# EAGLE design bricl_i2c_3axis_lis331hh (EAGLE 7.2.0)
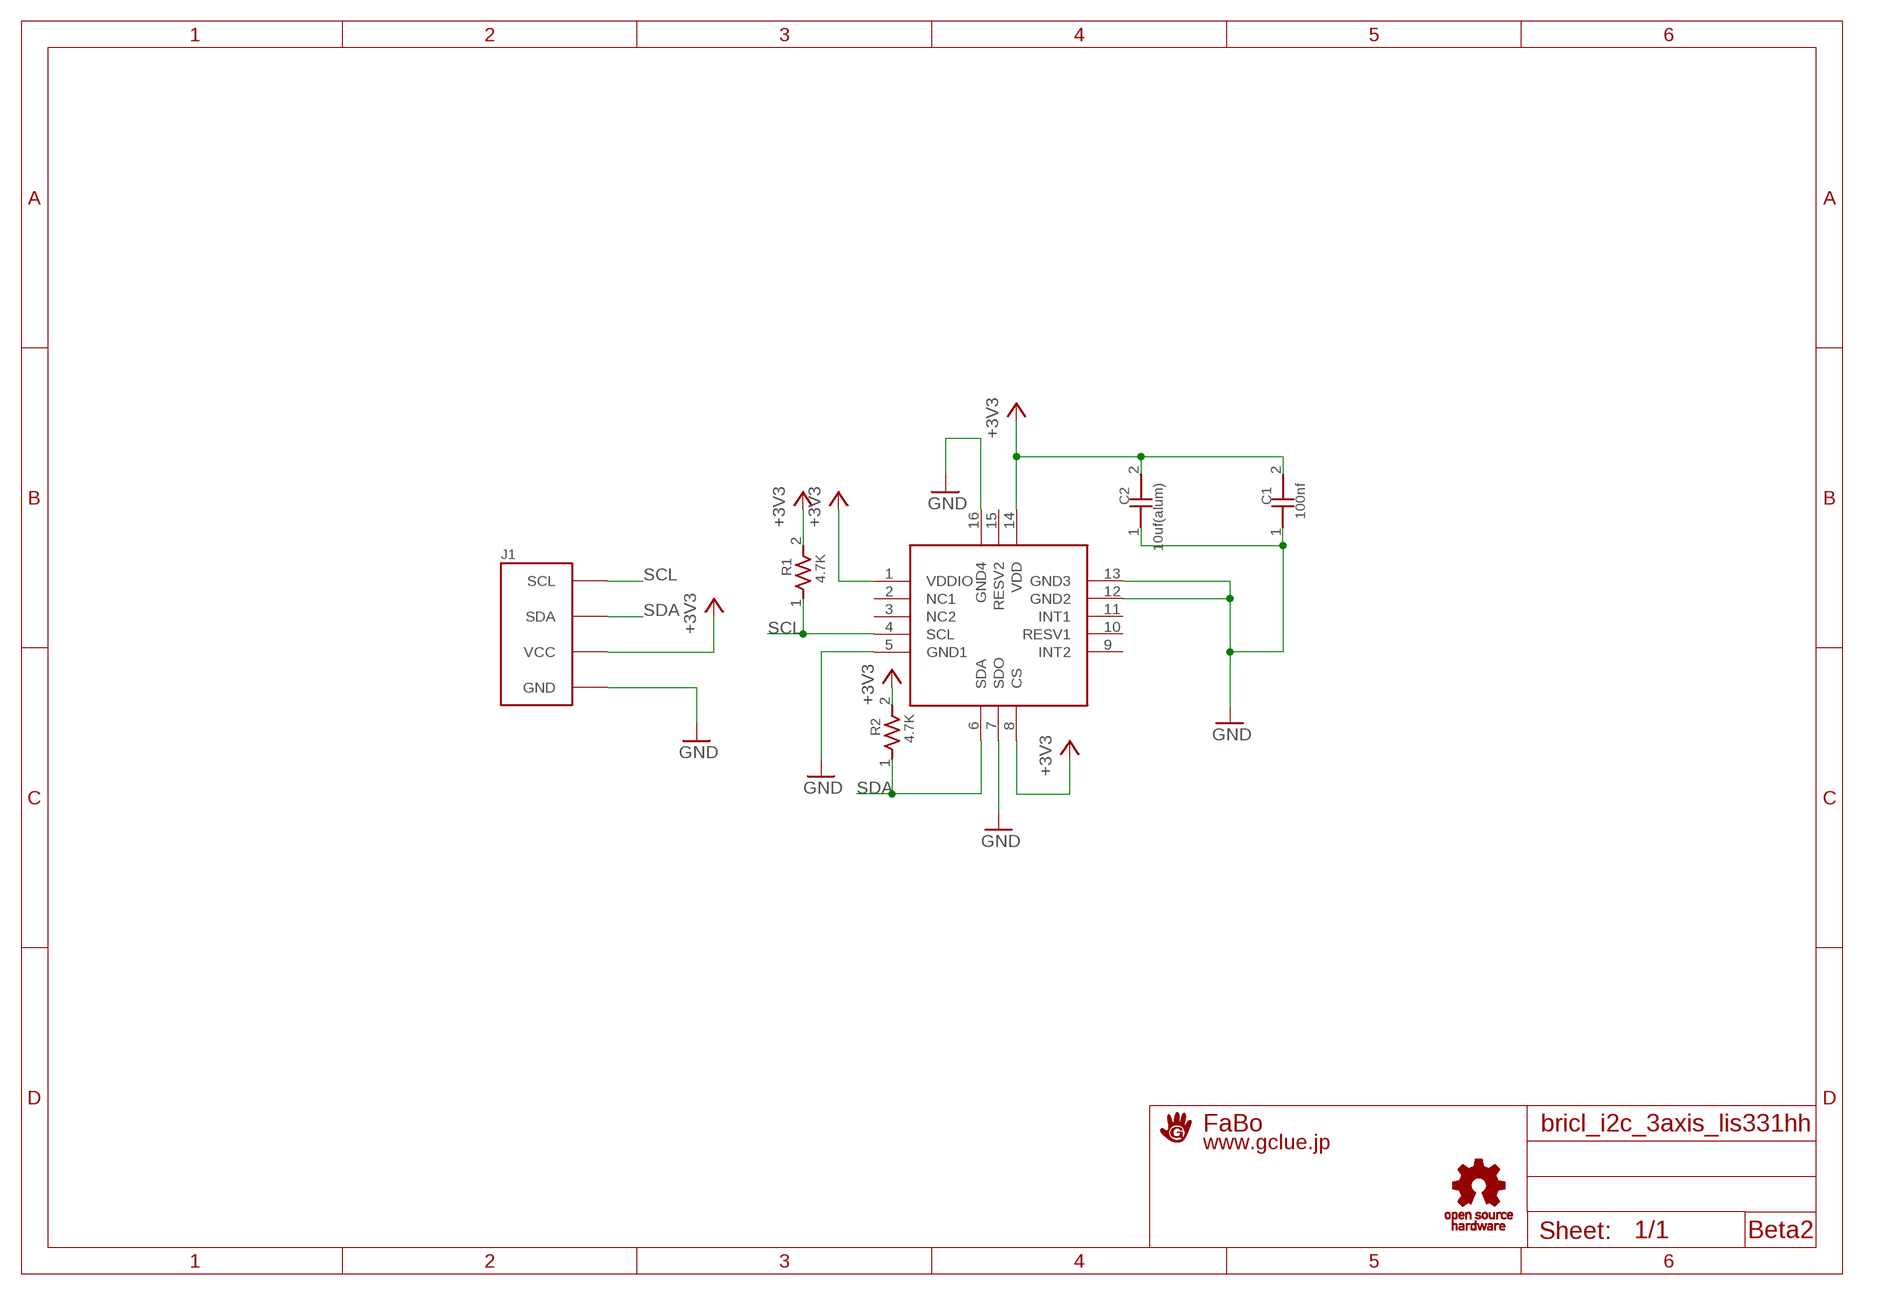
[diagram p0: schematic, sheet 1]

## Parts
C1  100nf  CAPACITOR0603  [0603]
C2  10uf(alum)  CAPACITOR0603  [0603]
J1  BRICK_I2C  [BRICK_I2C]
R1  4.7K  RESISTOR0603  [0603]
R2  4.7K  RESISTOR0603  [0603]
U$1  ST-LIS331HH  [ST-LIS331HH]
U$2  A4L-LOC-FABO_M  [LOGO_FABO_M]
U$3  LOGO_OSHW_T-M  [LOGO_OSHW_T_M]

## Nets
+3V3: C1.2 C2.2 J1.VCC R1.2 R2.2 U$1.1(VDDIO) U$1.8(CS) U$1.14(VDD)
GND: C1.1 C2.1 J1.GND U$1.5(GND1) U$1.7(SDO) U$1.12(GND2) U$1.13(GND3) U$1.16(GND4)
SCL: J1.SCL R1.1 U$1.4(SCL)
SDA: J1.SDA R2.1 U$1.6(SDA)
Unconnected: U$1.2(NC1) U$1.3(NC2) U$1.9(INT2) U$1.10(RESV1) U$1.11(INT1) U$1.15(RESV2)

## Notes on the sheet
- Beta2

## Library data of the parts
C1 C2 = GClue-Capacitor:CAPACITOR
J1 = gclue:BRICK_I2C: FaBo Brick 4pin(I2C)
R1 R2 = GClue-Resistors:RESISTOR
U$1 = GClue-Mems:ST-LIS331HH
U$2 = gclue:A4L-LOC: FaBo A4 FRAME
U$3 = gclue:LOGO_OSHW_T

## Board
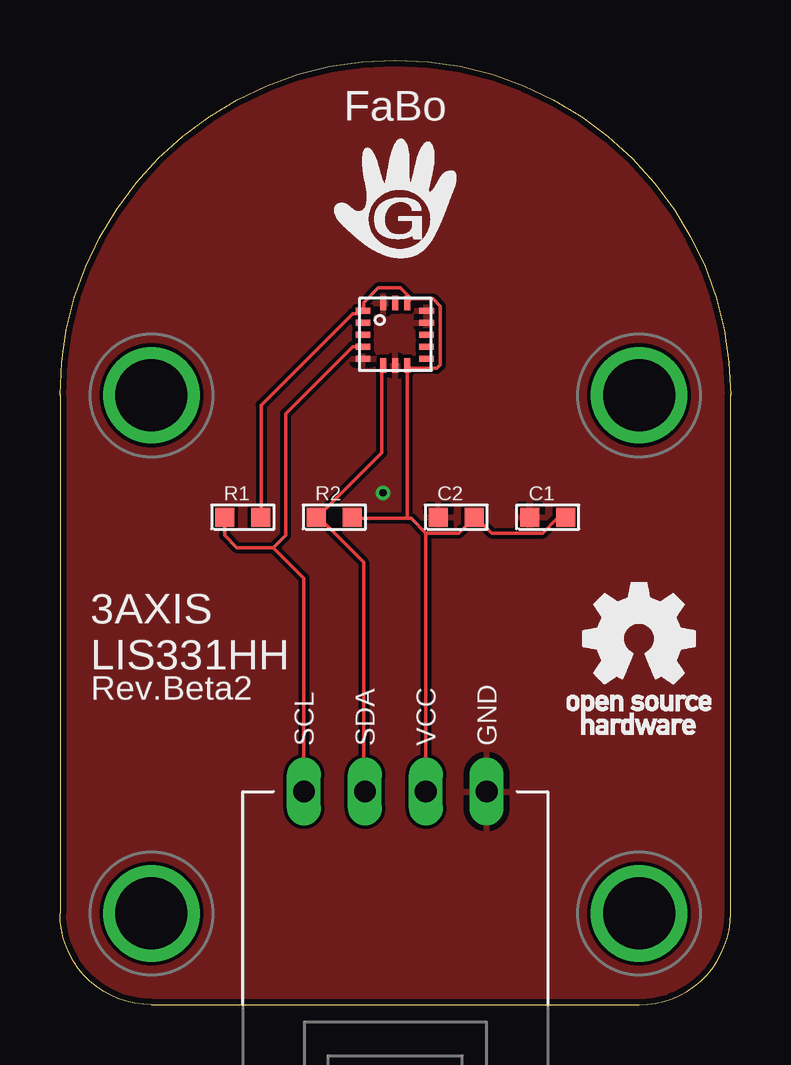
[diagram p1: board, top side]
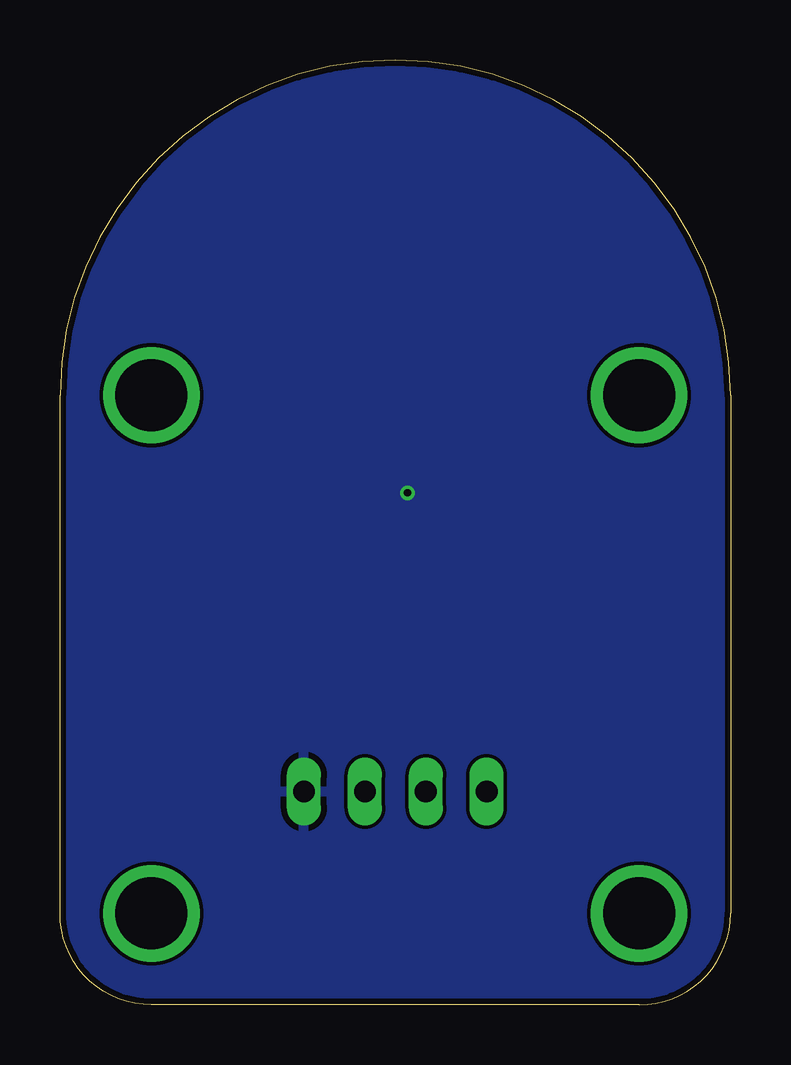
[diagram p2: board, bottom side, seen from below]

Size 27.94 x 39.37 mm. Coordinates in mm from the lower left corner, seen from the top.
Copper layers (1*16): Top 0.035mm / dielectric 1.5mm / Bottom 0.035mm
Design rules "Elecrow_2-layer_eagle_rule": minimum track width 6mil, minimum drill 12mil, track to track 6mil, track to pad 6mil, pad to pad 6mil, via to via 6mil, smd to smd 0mil, copper to edge 10mil, drill to drill 10mil, minimum pad ring 10mil, minimum via ring 6mil, stop-mask expansion 2mil, vias tented up to drill 100mil, thermal gap 10mil

### Footprints (pad centres in the part's own frame; a part is rotated, then mirrored left to right if it is on the bottom)
0603 = smd 0.8 x 0.8: 1 -0.75,0; 2 0.75,0
BRICK_I2C = drill 0.9 long: GND 3.81,-10.16; SCL -3.81,-10.16; SDA -1.27,-10.16; VCC 1.27,-10.16 | drill 3 pad 3.81: P$1 -10.16,6.35; P$2 10.16,6.35; P$3 -10.16,-15.24; P$4 10.16,-15.24
ST-LIS331HH = smd 0.6 x 0.25: 1 -1.35,0.98; 2 -1.35,0.48; 3 -1.35,-0.02; 4 -1.35,-0.52; 5 -1.35,-1.02; 9 1.3,-1.02; 10 1.3,-0.52; 11 1.3,-0.02; 12 1.3,0.48; 13 1.3,0.98 | smd 0.25 x 0.6: 6 -0.5,-1.3; 7 0,-1.3; 8 0.5,-1.3; 14 0.5,1.3; 15 0,1.3; 16 -0.5,1.3

### Placement (x,y rotation side)
C1  20.32,20.32 0 top
C2  16.51,20.32 0 top
J1  13.97,19.05 0 top
R1  7.62,20.32 0 top
R2  11.43,20.32 0 top
U$1  13.97,27.94 0 top
U$2  13.97,33.66 0 top
U$3  24.13,15.24 0 top

### Tracks (layer width: path | path; a pad name or v marks a point on that pad's centre or on a via)
+3V3
  Top 0.152: 14.48,26.52 15.7,26.52 15.85,26.67 15.85,29.11 15.54,29.41 14.63,29.41 | 14.63,29.41 14.48,29.26 U$1.14 | 14.63,29.41 14.17,29.87 13.26,29.87 12.65,29.26 12.65,28.96 U$1.1 12.5,28.8 12.19,28.8 8.38,24.99 8.38,20.42 R1.2 | 14.48,20.27 14.63,20.27 15.24,19.66 | 14.48,20.27 12.19,20.27 R2.2 | 15.24,19.66 16.61,19.66 17.22,20.27 C2.2 17.37,20.27 17.98,19.66 20.12,19.66 20.73,20.27 21.03,20.27 C1.2 | 15.24,19.66 J1.VCC | 14.48,20.27 14.48,26.52 | 14.48,26.52 U$1.8
GND  (via drill 0.3)
  other vias: 13.46,21.34
  pour Bottom: -1.27,-1.27 29.21,-1.27 29.21,40.64 -1.27,40.64
  pour Top: -1.27,-1.27 29.21,-1.27 29.21,40.64 -1.27,40.64
SCL
  Top 0.152: 8.89,19.05 9.4,19.56 9.4,24.64 12.19,27.43 12.5,27.43 U$1.4 | R1.1 6.86,20.07 6.86,19.56 7.37,19.05 8.89,19.05 | 8.89,19.05 10.16,17.78 J1.SCL
SDA
  Top 0.152: U$1.6 13.41,26.52 13.41,23.01 10.82,20.42 R2.1 10.82,20.27 12.65,18.44 12.65,8.99 J1.SDA

### Text on the board
tPlace: 3AXIS / LIS331HH | Rev.Beta2